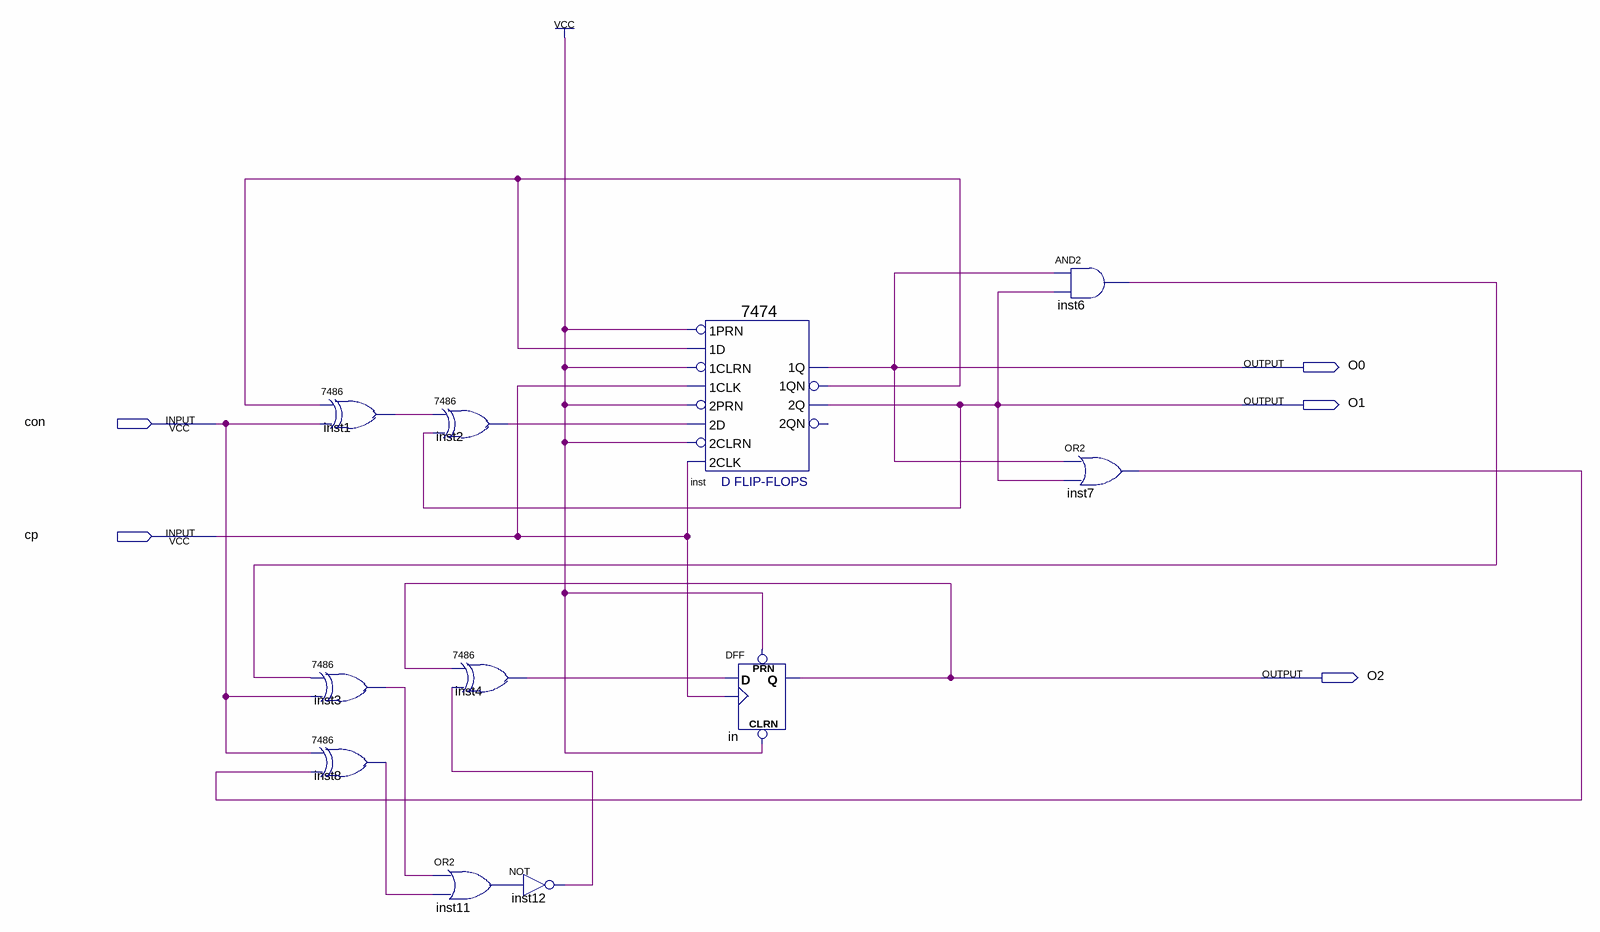
[diagram p0: schematic sheet]
// Quartus schematic 6.bdf as structural Verilog: 11 symbols, 5 pins
module \6  (
  input  con,
  input  cp,
  output O0,
  output O1,
  output O2
);

  wire inst1_1, inst2_1, inst3_1, inst4_1, inst6_out, inst7_out, inst8_1, inst11_out, inst12_out, inst_1qn;

  \7486  inst1 (.\2 (inst_1qn), .\3 (con), .\1 (inst1_1));
  \7486  inst3 (.\2 (inst6_out), .\3 (con), .\1 (inst3_1));
  \7486  inst8 (.\2 (con), .\3 (inst7_out), .\1 (inst8_1));
  \7486  inst2 (.\2 (inst1_1), .\3 (O1), .\1 (inst2_1));
  \7486  inst4 (.\2 (O2), .\3 (inst12_out), .\1 (inst4_1));
  or inst11 (inst11_out, inst3_1, inst8_1);
  not inst12 (inst12_out, inst11_out);
  \7474  inst (
    .\2D (inst2_1), .\2PRN (1'b1), .\1CLK (cp), .\1D (inst_1qn), .\1PRN (1'b1), .\2CLK (cp), .\2CLRN (1'b1),
    .\1CLRN (1'b1), .\1QN (inst_1qn), .\2Q (O1), .\1Q (O0));  // open: 2QN
  DFF in (.CLRN(1'b1), .CLK(cp), .D(inst4_1), .PRN(1'b1), .Q(O2));
  and inst6 (inst6_out, O0, O1);
  or inst7 (inst7_out, O0, O1);
endmodule
